# Altium schematic sheet Sensor2.SchDoc
size A3
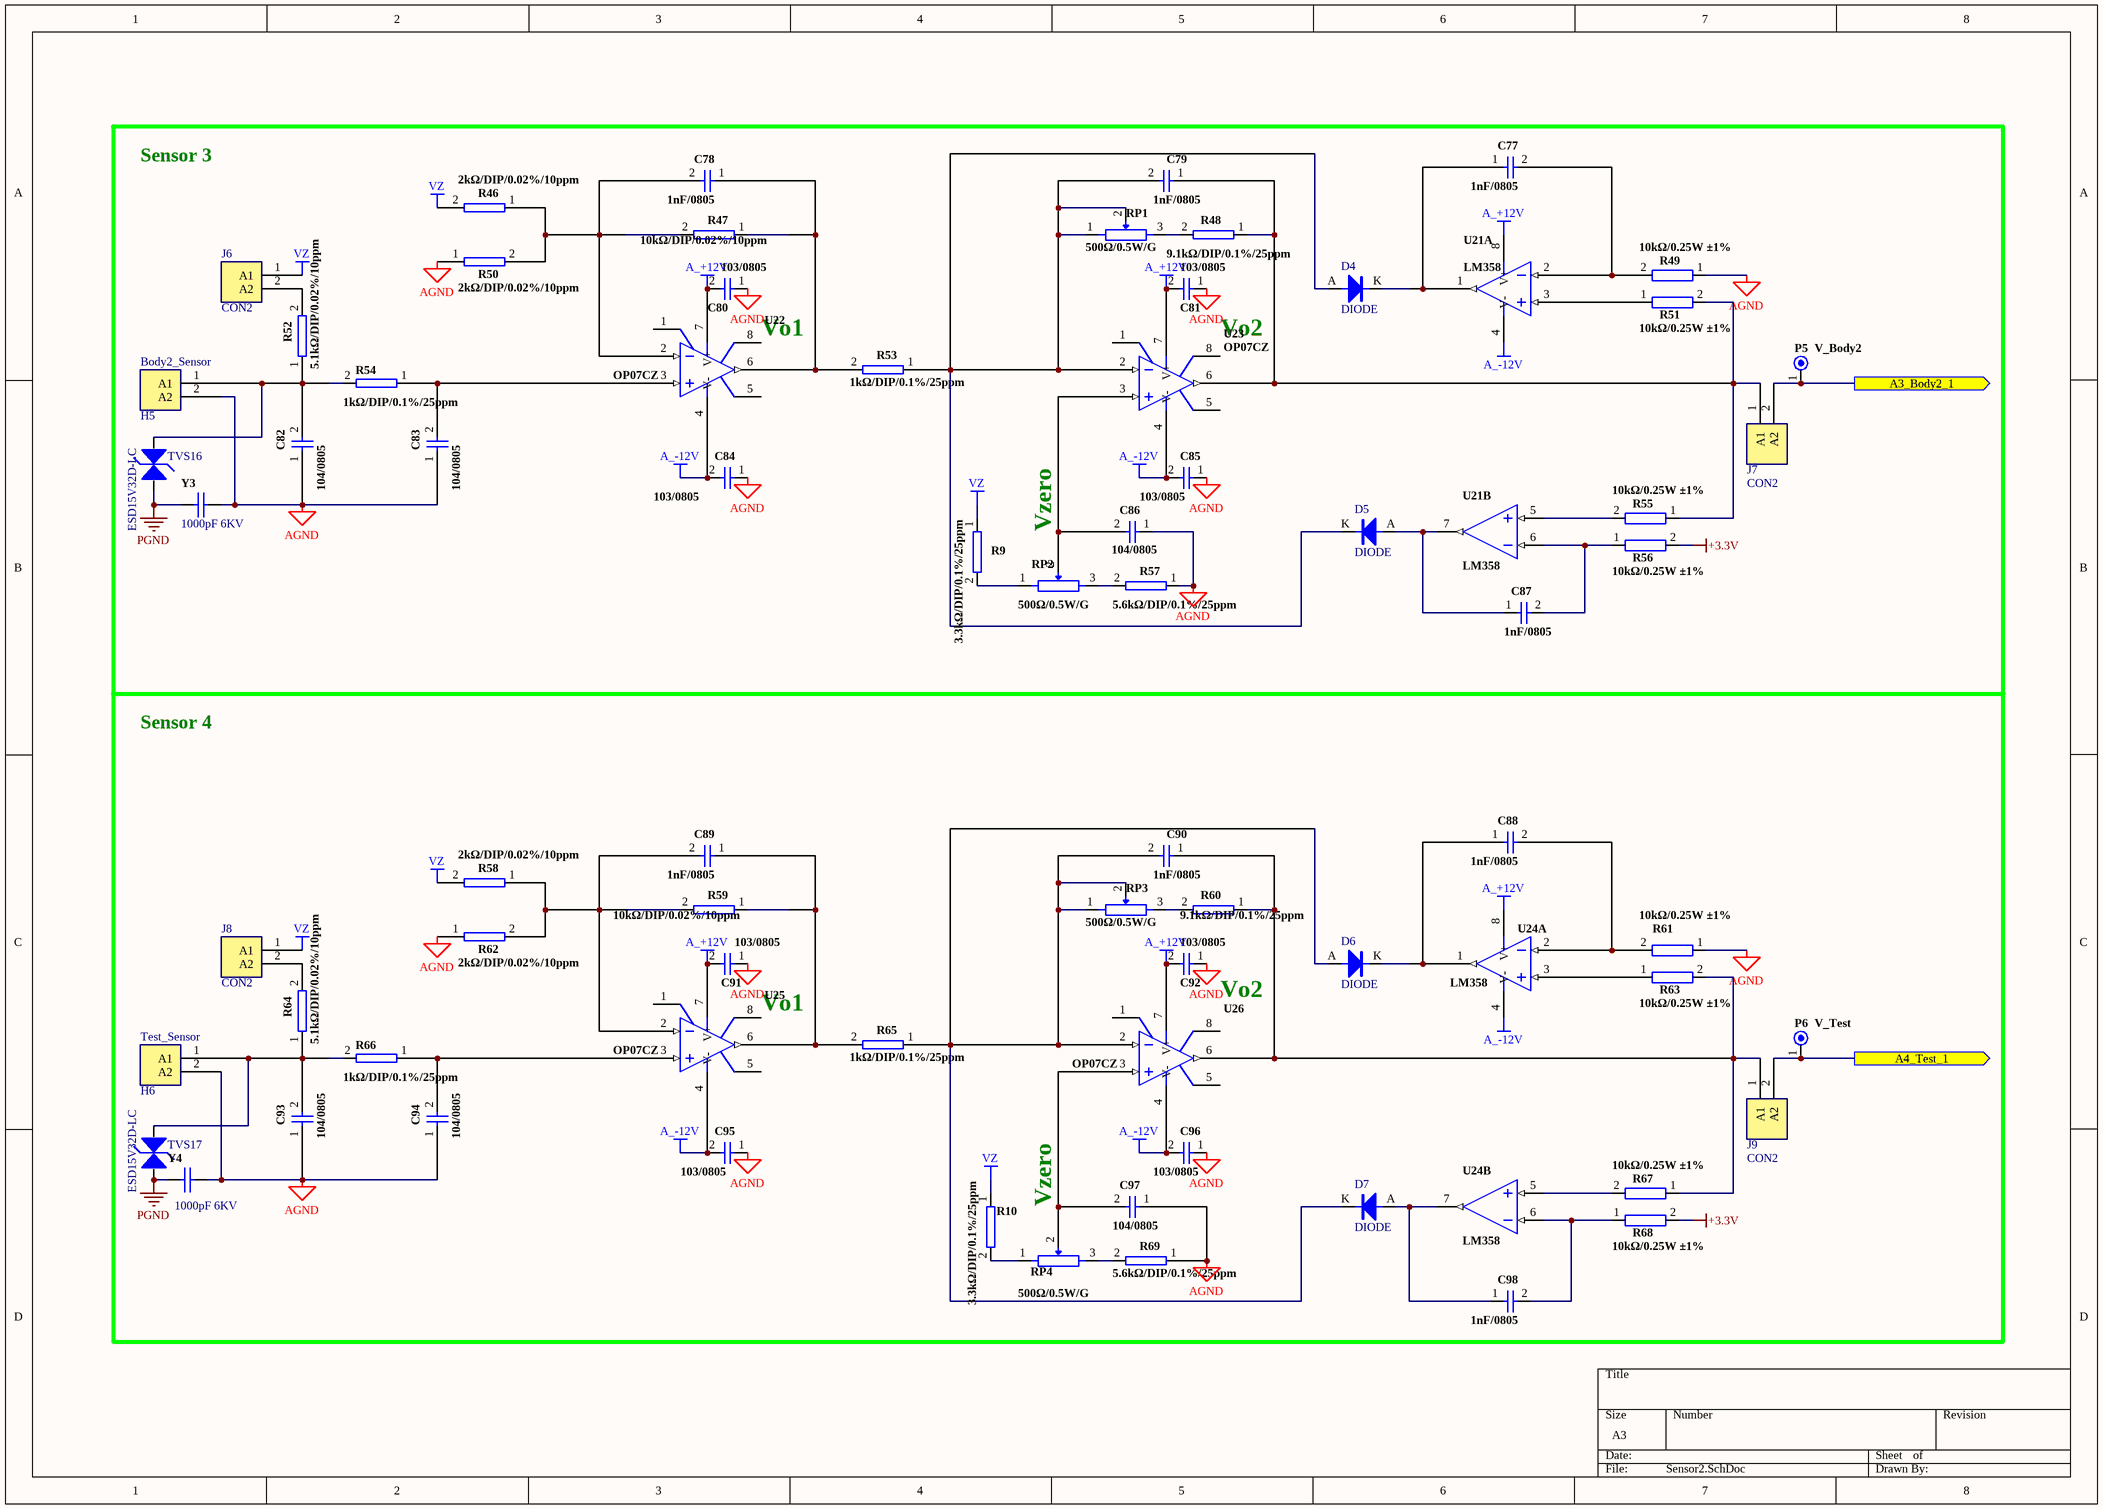
[diagram p0: Sensor2.SchDoc]

## Parts
C77  1nF/0805  [C0805]
C78  1nF/0805  [C0805]
C79  1nF/0805  [C0805]
C80  103/0805  [C0805]
C81  103/0805  [C0805]
C82  104/0805  [C0805]
C83  104/0805  [C0805]
C84  103/0805  [C0805]
C85  103/0805  [C0805]
C86  104/0805  [C0805]
C87  1nF/0805  [C0805]
C88  1nF/0805  [C0805]
C89  1nF/0805  [C0805]
C90  1nF/0805  [C0805]
C91  103/0805  [C0805]
C92  103/0805  [C0805]
C93  104/0805  [C0805]
C94  104/0805  [C0805]
C95  103/0805  [C0805]
C96  103/0805  [C0805]
C97  104/0805  [C0805]
C98  1nF/0805  [C0805]
D4  DIODE  [SOD123]
D5  DIODE  [SOD123]
D6  DIODE  [SOD123]
D7  DIODE  [SOD123]
H5  Body2_Sensor  [XH2]
H6  Test_Sensor  [XH2]
J6  CON2  [2Pin-2.54]
J7  CON2  [2Pin-2.54]
J8  CON2  [2Pin-2.54]
J9  CON2  [2Pin-2.54]
P5  V_Body2  [TESTSMD]
P6  V_Test  [TESTSMD]
R9  3.3kΩ/DIP/0.1%/25ppm  [AXIAL0.4]
R10  3.3kΩ/DIP/0.1%/25ppm  [AXIAL0.4]
R46  2kΩ/DIP/0.02%/10ppm  [AXIAL-0.6-R]
R47  10kΩ/DIP/0.02%/10ppm  [AXIAL-0.6-R]
R48  9.1kΩ/DIP/0.1%/25ppm  [AXIAL0.4]
R49  10kΩ/0.25W ±1%  [R0805]
R50  2kΩ/DIP/0.02%/10ppm  [AXIAL-0.6-R]
R51  10kΩ/0.25W ±1%  [R0805]
R52  5.1kΩ/DIP/0.02%/10ppm  [AXIAL-0.6-R]
R53  1kΩ/DIP/0.1%/25ppm  [AXIAL0.4]
R54  1kΩ/DIP/0.1%/25ppm  [AXIAL0.4]
R55  10kΩ/0.25W ±1%  [R0805]
R56  10kΩ/0.25W ±1%  [R0805]
R57  5.6kΩ/DIP/0.1%/25ppm  [AXIAL0.4]
R58  2kΩ/DIP/0.02%/10ppm  [AXIAL-0.6-R]
R59  10kΩ/DIP/0.02%/10ppm  [AXIAL-0.6-R]
R60  9.1kΩ/DIP/0.1%/25ppm  [AXIAL0.4]
R61  10kΩ/0.25W ±1%  [R0805]
R62  2kΩ/DIP/0.02%/10ppm  [AXIAL-0.6-R]
R63  10kΩ/0.25W ±1%  [R0805]
R64  5.1kΩ/DIP/0.02%/10ppm  [AXIAL-0.6-R]
R65  1kΩ/DIP/0.1%/25ppm  [AXIAL0.4]
R66  1kΩ/DIP/0.1%/25ppm  [AXIAL0.4]
R67  10kΩ/0.25W ±1%  [R0805]
R68  10kΩ/0.25W ±1%  [R0805]
R69  5.6kΩ/DIP/0.1%/25ppm  [AXIAL0.4]
RP1  500Ω/0.5W/G  [3224W]
RP2  500Ω/0.5W/G  [3224W]
RP3  500Ω/0.5W/G  [3224W]
RP4  500Ω/0.5W/G  [3224W]
TVS16  ESD15V32D-LC  [SOD323]
TVS17  ESD15V32D-LC  [SOD323]
U21  LM358  [SO-8]  (parts A,B of 2)
U22  OP07CZ  [SO-8]
U23  OP07CZ  [SO-8]
U24  LM358  [SO-8]  (parts A,B of 2)
U25  OP07CZ  [SO-8]
U26  OP07CZ  [SO-8]
Y3  1000pF 6KV  [CY1002]
Y4  1000pF 6KV  [CY1002]

## Ports
A3_Body2_1 (out), A4_Test_1 (out)

## Nets
+3.3V: R56.2 R68.2
A_+12V: C80.2 C81.2 C91.2 C92.2 U21.8(V+) U22.7(V+) U23.7(V+) U24.8(V+) U25.7(V+) U26.7(V+)
A_-12V: C84.2 C85.2 C95.2 C96.2 U21.4(V-) U22.4(V-) U23.4(V-) U24.4(V-) U25.4(V-) U26.4(V-)
AGND: C80.1 C81.1 C82.1 C83.1 C84.1 C85.1 C86.1 C91.1 C92.1 C93.1 C94.1 C95.1 C96.1 C97.1 H5.2(A2) H6.2(A2) R49.1 R50.1 R57.1 R61.1 R62.1 R69.1 Y3.2 Y4.2
PGND: TVS16.2 TVS17.2 Y3.1 Y4.1
VZ: J6.1(A1) J8.1(A1) R9.1 R10.1 R46.2 R58.2
A3_Body2_1: J7.2(A2) P5.1 ; port A3_Body2_1
A4_Test_1: J9.2(A2) P6.1 ; port A4_Test_1
NetC77_1: C77.1 D4.K U21.1
NetC77_2: C77.2 R49.2 U21.2
NetC78_1: C78.1 R47.1 R53.2 U22.6
NetC78_2: C78.2 R46.1 R47.2 R50.2 U22.2
NetC79_1: C79.1 J7.1(A1) R48.1 R51.2 R55.1 U23.6
NetC79_2: C79.2 D4.A D5.K R53.1 RP1.1 RP1.2 U23.2
NetC82_2: C82.2 H5.1(A1) R52.1 R54.2 TVS16.1
NetC83_2: C83.2 R54.1 U22.3
NetC86_2: C86.2 RP2.2 U23.3
NetC87_1: C87.1 D5.A U21.7
NetC87_2: C87.2 R56.1 U21.6
NetC88_1: C88.1 D6.K U24.1
NetC88_2: C88.2 R61.2 U24.2
NetC89_1: C89.1 R59.1 R65.2 U25.6
NetC89_2: C89.2 R58.1 R59.2 R62.2 U25.2
NetC90_1: C90.1 J9.1(A1) R60.1 R63.2 R67.1 U26.6
NetC90_2: C90.2 D6.A D7.K R65.1 RP3.1 RP3.2 U26.2
NetC93_2: C93.2 H6.1(A1) R64.1 R66.2 TVS17.1
NetC94_2: C94.2 R66.1 U25.3
NetC97_2: C97.2 RP4.2 U26.3
NetC98_1: C98.1 D7.A U24.7
NetC98_2: C98.2 R68.1 U24.6
NetJ6_2: J6.2(A2) R52.2
NetJ8_2: J8.2(A2) R64.2
NetR9_2: R9.2 RP2.1
NetR10_2: R10.2 RP4.1
NetR48_2: R48.2 RP1.3
NetR51_1: R51.1 U21.3
NetR55_2: R55.2 U21.5
NetR57_2: R57.2 RP2.3
NetR60_2: R60.2 RP3.3
NetR63_1: R63.1 U24.3
NetR67_2: R67.2 U24.5
NetR69_2: R69.2 RP4.3

Not connected (* = marked no-connect by the designer): U22 1 5 8; U23 1 5 8; U25 1 5 8; U26 1 5 8

## Notes on the sheet
- Sensor 3
- Vo1
- Vo2
- Vzero
- Sensor 4

## Library data of the parts
C77-C79 C87-C90 C98 = CAP: 贴片电容 1nF/25V ±1% C0805
C80 C81 C84 C85 C91 C92 C95 C96 = CAP: 贴片电容 103/25V ±1% C0805
C82 C83 C86 C93 C94 C97 = CAP: 贴片电容 104/25V ±1% C0805
D4-D7 = DIODE: 高速开关二极管 IN4148 1V 150mA SOD123
H5 H6 = CON2: 插座式端子 XH2.54-2P 250V(DC/AC) 3A
J6-J9 = CON2: 单排排针（2针）2.54mm 2Pin-2.54
P5 P6 = CON1
R9 R10 = RES2: 高精度电阻 3.3kΩ DIP 0.25W ±0.1% 25ppm AXIAL0.4
R46 R50 R58 R62 = RES2: 高精度电阻 2kΩ DIP 0.25W ±0.02% 10ppm AXIAL-0.6-R
R47 R59 = RES2: 高精度电阻 10kΩ DIP 0.25W ±0.02% 10ppm AXIAL-0.6-R
R48 R60 = RES2: 高精度电阻 9.1kΩ DIP 0.25W ±0.1% 25ppm AXIAL0.4
R49 R51 R55 R56 R61 R63 R67 R68 = RES2: 贴片电阻 10kΩ 0.25W ±1% R0805
R52 R64 = RES2: 高精度电阻 5.1kΩ DIP 0.25W ±0.02% 10ppm AXIAL-0.6-R
R53 R54 R65 R66 = RES2: 高精度电阻 1kΩ DIP 0.25W ±0.1% 25ppm AXIAL0.4
R57 R69 = RES2: 高精度电阻 5.6kΩ DIP 0.25W ±0.1% 25ppm AXIAL0.4
RP1-RP4 = RPOT: 高精密可调电位器 500Ω/0.5W/G 3224W
TVS16 TVS17 = TVS: ESD静电二极管 ESD15V32D-LC 15V 15KV 40A SOD323
U21 U24 = MC1458D: 双运算放大器 LM358 SO-8
U22 U23 U25 U26 = OP07CZ: 运算放大器 OP07CZ SO-8
Y3 Y4 = CAP: 安规电容 1000pF 6KV ±20% CY1002; C: 1000PF/安规Y; 物: *; 部: *; 供: *